# EAGLE design Board_mkIII (EAGLE 6.5.0)
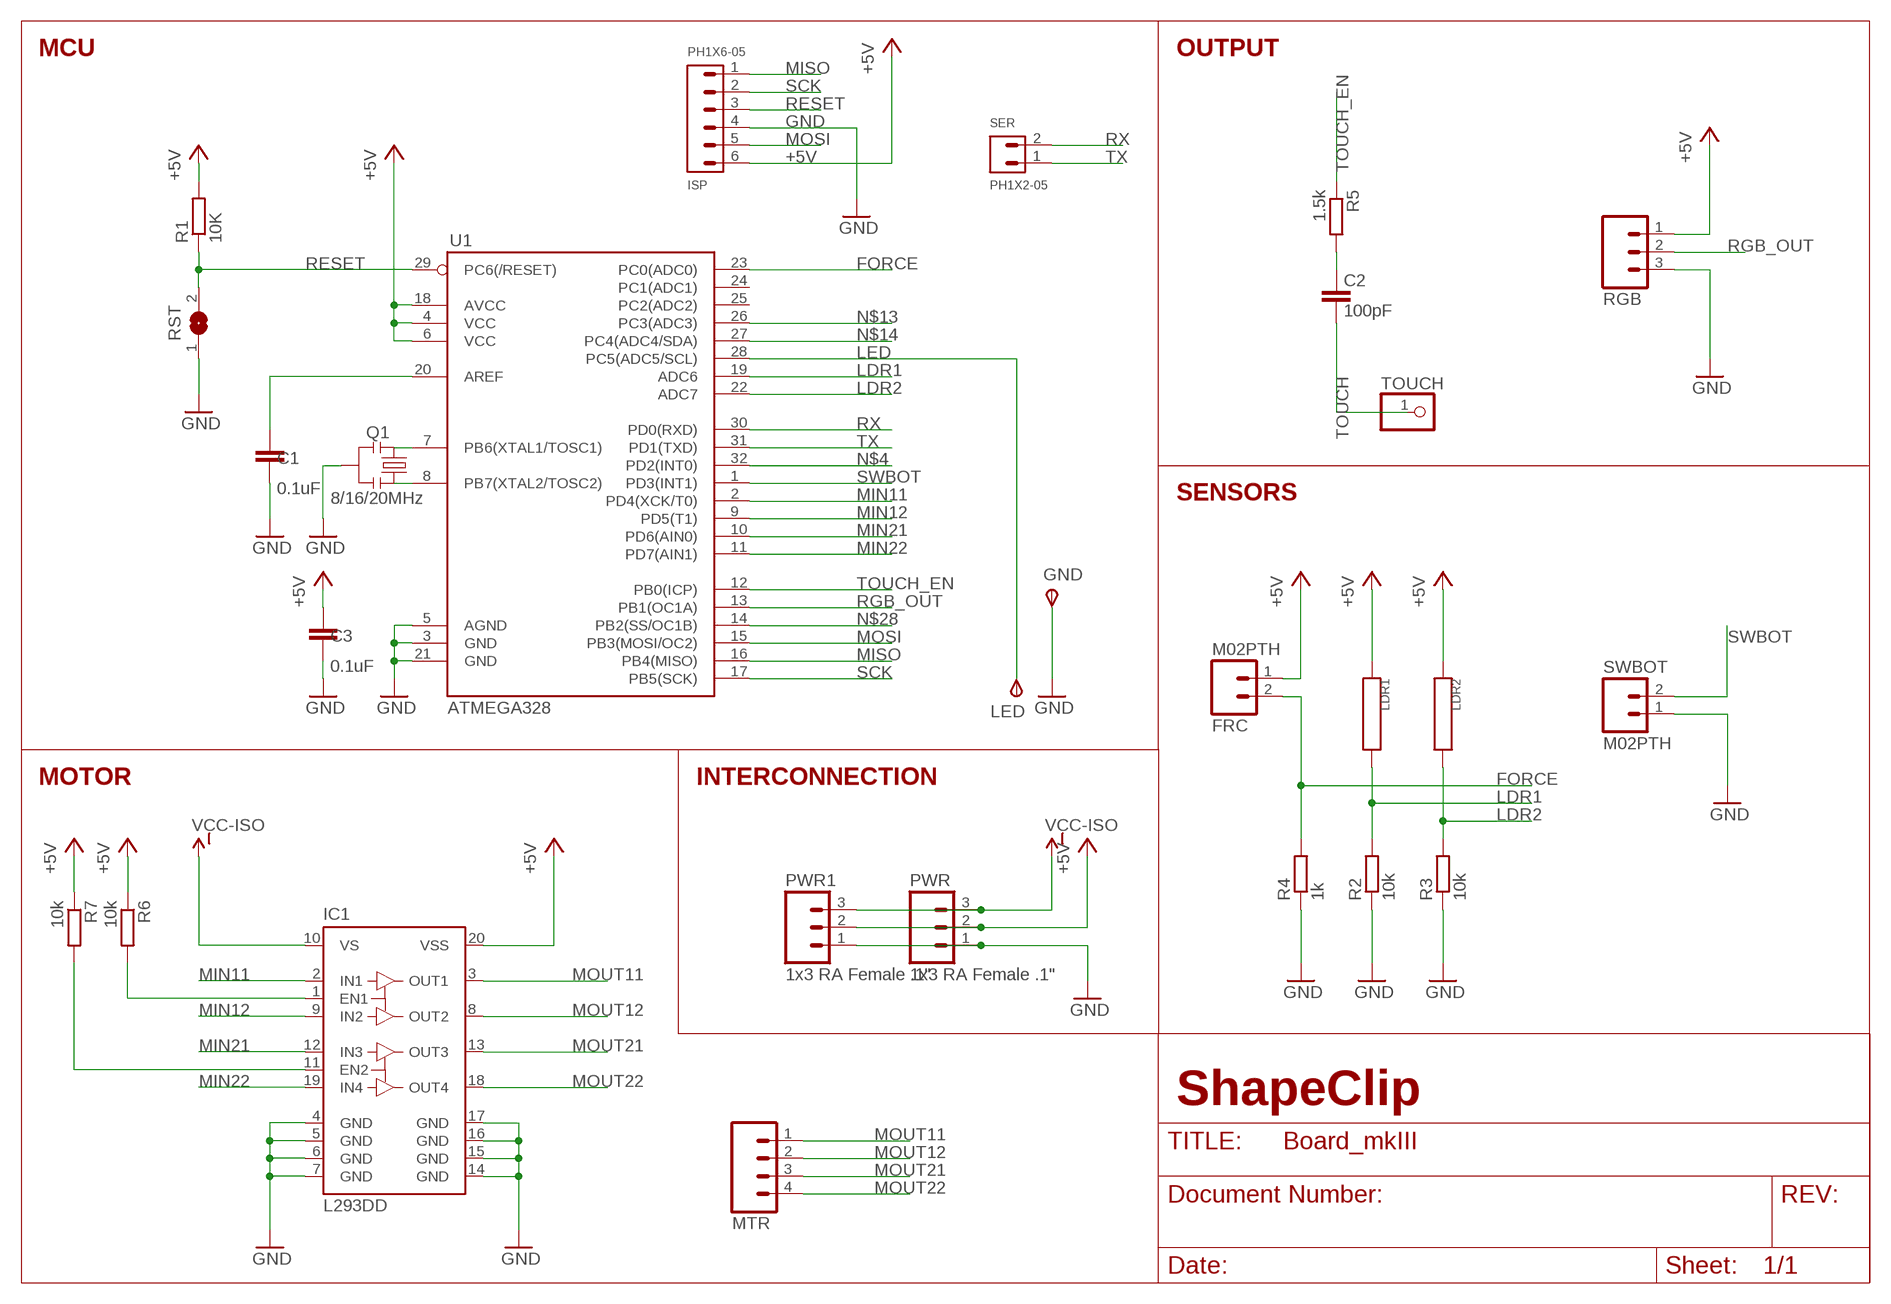
[diagram p0: schematic, sheet 1]

## Parts
C1  0.1uF  C-EUC0603  [C0603]
C2  100pF  C-EUC0603  [C0603]
C3  0.1uF  C-EUC0603  [C0603]
FRC  M02PTH  [1X02]
GND  TPSTP20SQ  [TP20SQ]
IC1  L293DD  [SO20]
ISP  PH1X6-05  [PH005-1-6]
LDR1  DR3-31-LDRLONG  [DR3-31-LDR_L]
LDR2  DR3-31-LDRLONG  [DR3-31-LDR_L]
LED  TPSTP20SQ  [TP20SQ]
MTR  M04PTH  [1X04]
PWR  1x3 RA Female .1"  PHD_FEMALE_3_90DEG  [PHD_FEMALE_3_90DEG]
PWR1  1x3 RA Female .1"  PHD_FEMALE_3_90DEG  [PHD_FEMALE_3_90DEG]
Q1  8/16/20MHz  RESONATOR16MHZ  [RESONATOR-SMD]
R1  10K  R-EU_R0603  [R0603]
R2  10k  R-EU_R0603  [R0603]
R3  10k  R-EU_R0603  [R0603]
R4  1k  R-EU_R0603  [R0603]
R5  1.5k  R-EU_R0603  [R0603]
R6  10k  R-EU_R0603  [R0603]
R7  10k  R-EU_R0603  [R0603]
RGB  M03PTH  [1X03]
RST  SJW  [SJW]
SER  PH1X2-05  [PH005-1-2]
SWBOT  M02PTH  [1X02]
TOUCH  PINHD-1X1  [1X01]
U1  ATMEGA328  ATMEGA168  [TQFP32-08]

## Nets
+5V: C3.2 FRC.1 IC1.20(VSS) ISP.6 LDR1.1 LDR2.1 PWR1.2 PWR.2 R1.2 R6.1 R7.1 RGB.1 U1.4(VCC) U1.6(VCC) U1.18(AVCC)
FORCE: FRC.2 R4.2 U1.23(PC0(ADC0))
GND [vcc]: C1.1 C3.1 GND.TP(PP) IC1.4(GND) IC1.5(GND) IC1.6(GND) IC1.7(GND) IC1.14(GND) IC1.15(GND) IC1.16(GND) IC1.17(GND) ISP.4 PWR1.1 PWR.1 Q1.2 R2.1 R3.1 R4.1 RGB.3 RST.1 SWBOT.1 U1.3(GND) U1.5(AGND) U1.21(GND)
LDR1: LDR1.2 R2.2 U1.19(ADC6)
LDR2: LDR2.2 R3.2 U1.22(ADC7)
LED: LED.TP(PP) U1.28(PC5(ADC5/SCL))
MIN11: IC1.2(IN1) U1.2(PD4(XCK/T0))
MIN12: IC1.9(IN2) U1.9(PD5(T1))
MIN21: IC1.12(IN3) U1.10(PD6(AIN0))
MIN22: IC1.19(IN4) U1.11(PD7(AIN1))
MISO: ISP.1 U1.16(PB4(MISO))
MOSI: ISP.5 U1.15(PB3(MOSI/OC2))
MOUT11: IC1.3(OUT1) MTR.1
MOUT12: IC1.8(OUT2) MTR.2
MOUT21: IC1.13(OUT3) MTR.3
MOUT22: IC1.18(OUT4) MTR.4
N$1: Q1.1 U1.8(PB7(XTAL2/TOSC2))
N$2: Q1.3 U1.7(PB6(XTAL1/TOSC1))
N$3: C1.2 U1.20(AREF)
N$4: U1.32(PD2(INT0))
N$5: C2.2 R5.2
N$6: IC1.1(EN1) R6.2
N$7: IC1.11(EN2) R7.2
N$13: U1.26(PC3(ADC3))
N$14: U1.27(PC4(ADC4/SDA))
N$28: U1.14(PB2(SS/OC1B))
RESET: ISP.3 R1.1 RST.2 U1.29(PC6(/RESET))
RGB_OUT: RGB.2 U1.13(PB1(OC1A))
RX: SER.2 U1.30(PD0(RXD))
SCK: ISP.2 U1.17(PB5(SCK))
SWBOT: SWBOT.2 U1.1(PD3(INT1))
TOUCH: C2.1 TOUCH.1
TOUCH_EN: R5.1 U1.12(PB0(ICP))
TX: SER.1 U1.31(PD1(TXD))
VCC-ISO: IC1.10(VS) PWR1.3 PWR.3
Unconnected: U1.24(PC1(ADC1)) U1.25(PC2(ADC2))

## Notes on the sheet
- MCU | OUTPUT
- SENSORS
- MOTOR | INTERCONNECTION
- ShapeClip

## Library data of the parts
C1-C3 = resistor:C-EU: CAPACITOR, European symbol
FRC SWBOT = SparkFun-Connectors:M02: Standard 2-pin 0.1" header. Use with - straight break away headers ( PRT-00116) - right angle break away headers (PRT-00553) - swiss pins (PRT-00743) - machine pins (PRT-00117) - female headers (PRT-00115) Molex polarized connector foot print use with: PRT-08233 with associated crimp pins and housings. 2.54_SCREWTERM for use with PRT-10571. 3.5mm Screw Terminal footprints for PRT-08084 5mm Screw Terminal footprints for use with PRT-08433
GND LED = testpad:TPS: TEST PIN
IC1 = st-microelectronics:L293DD: PUSH-PULL FOUR CHANNEL DRIVER WITH DIODES Source: http://www.st.com/stonline/books/pdf/docs/1330.pdf; OC_FARNELL: unknown
ISP = pel_hdr:PH1X6
LDR1 LDR2 = ShapeClip:DR3-31-LDR
MTR = SparkFun-Connectors:M04: Header 4 Standard 4-pin 0.1" header. Use with straight break away headers (SKU : PRT-00116), right angle break away headers (PRT-00553), swiss pins (PRT-00743), machine pins (PRT-00117), and female headers (PRT-00115). Molex polarized connector foot print use with SKU : PRT-08231 with associated crimp pins and housings. 1MM SMD Version SKU: PRT-10208
PWR PWR1 = ShapeClip:PHD_FEMALE_3_90DEG
Q1 = SparkFun-FreqCtrl:RESONATOR: Resonator Small SMD resonator. Used, eg, on the Arduino Pro/ Pro Mini boards. 8MHz- XTAL-08895 16MHz- XTAL-08900; PROD_ID: XTAL-08900; VALUE: 16MHz
R1-R7 = resistor:R-EU_: RESISTOR, European symbol
RGB = SparkFun-Connectors:M03: Header 3 Standard 3-pin 0.1" header. Use with straight break away headers (SKU : PRT-00116), right angle break away headers (PRT-00553), swiss pins (PRT-00743), machine pins (PRT-00117), and female headers (PRT-00115). Molex polarized connector foot print use with SKU : PRT-08232 with associated crimp pins and housings.
RST = jumper:SJ: SMD solder JUMPER
SER = pel_hdr:PH1X2
TOUCH = pinhead:PINHD-1X1: PIN HEADER
U1 = SparkFun:ATMEGA168

## Net classes
0 default: width 0.254 mm
1 vcc: width 0.254 mm

## Board
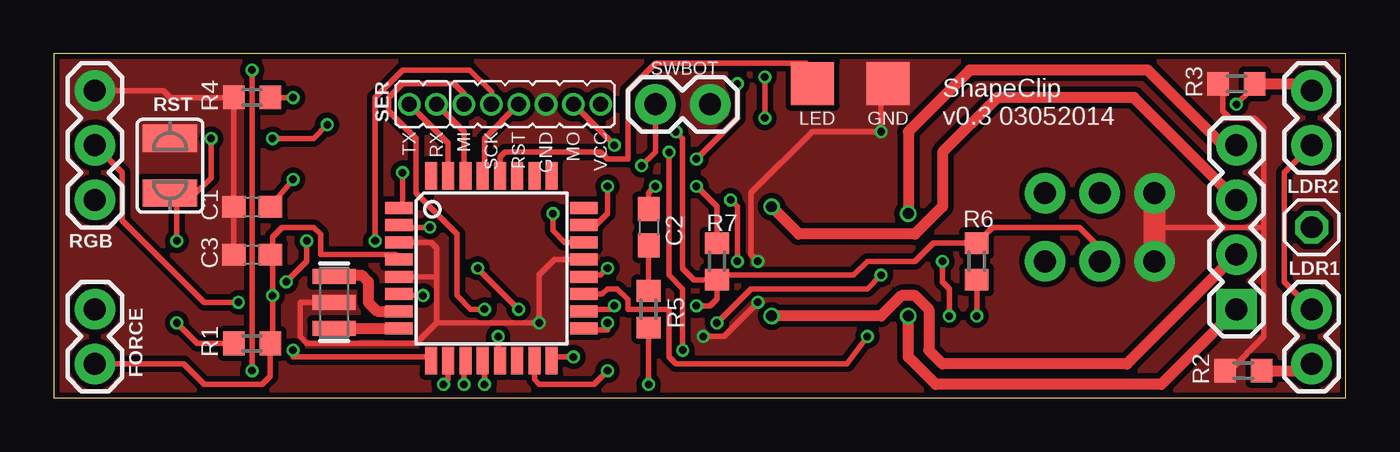
[diagram p1: board, top side]
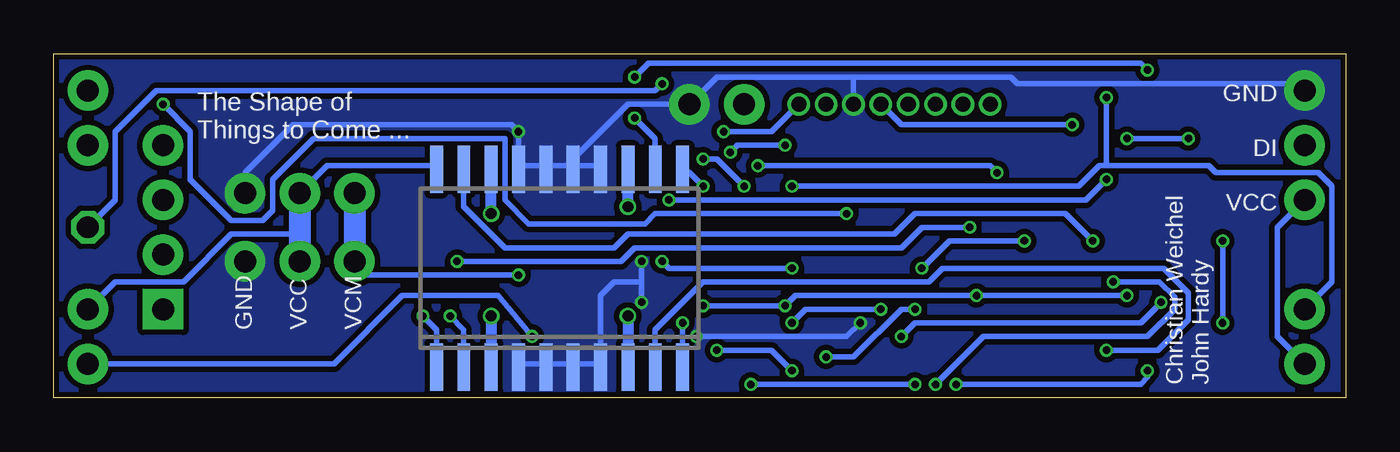
[diagram p2: board, bottom side, seen from below]

Size 60 x 16 mm. Coordinates in mm from the lower left corner, seen from the top.
Outline: 0,0 60,0 60,16 0,16 0,0
Copper layers (1*16): Top 0.018mm / dielectric 1.55mm / Bottom 0.018mm
Design rules "eC_2Layer_PClass6_BaseCopperO18_eCDefault": minimum track width 0.15mm, minimum drill 0.35mm, track to track 0.15mm, track to pad 0.15mm, pad to pad 0.15mm, via to via 0.15mm, smd to smd 0mil, copper to edge 0.25mm, drill to drill 0.35mm, minimum pad ring 0.175mm, minimum via ring 0.125mm, stop-mask expansion 0mil, vias tented up to drill 0.45mm, thermal gap 0.2mm

### Footprints (pad centres in the part's own frame; a part is rotated, then mirrored left to right if it is on the bottom)
C0603 = smd 1.1 x 1: 1 -0.85,0; 2 0.85,0
1X02 = drill 1.016 pad 1.88: 1 0,0; 2 2.54,0
TP20SQ = smd 2 x 2: TP 0,0
SO20 = smd 0.6 x 2.2: 1 -5.715,-4.6; 2 -4.445,-4.6; 3 -3.175,-4.6; 4 -1.905,-4.6; 5 -0.635,-4.6; 6 0.635,-4.6; 7 1.905,-4.6; 8 3.175,-4.6; 9 4.445,-4.6; 10 5.715,-4.6; 11 5.715,4.6; 12 4.445,4.6; 13 3.175,4.6; 14 1.905,4.6; 15 0.635,4.6; 16 -0.635,4.6; 17 -1.905,4.6; 18 -3.175,4.6; 19 -4.445,4.6; 20 -5.715,4.6
PH005-1-6 = drill 0.7 pad 1.016: 1 0,0; 2 1.27,0; 3 2.54,0; 4 3.81,0; 5 5.08,0; 6 6.35,0
DR3-31-LDR_L = drill 1.016 pad 1.88: 1 0,0; 2 2.54,0
1X04 = drill 1.016 pad 1.88 square: 1 0,0 | drill 1.016 pad 1.88: 2 2.54,0; 3 5.08,0; 4 7.62,0
PHD_FEMALE_3_90DEG = drill 1.016 pad 1.88: 1 0,0; 2 2.54,0; 3 5.08,0
RESONATOR-SMD = smd 0.7 x 2.014: 1 -1.2,0; 2 0,0; 3 1.2,0
R0603 = smd 1 x 1.1: 1 -0.85,0; 2 0.85,0
1X03 = drill 1.016 pad 1.88: 1 0,0; 2 2.54,0; 3 5.08,0
SJW = smd 1.27 x 2.54: 1 -1.27,0; 2 1.27,0
PH005-1-2 = drill 0.7 pad 1.016: 1 0,0; 2 1.27,0
1X01 = drill 1.016 octagon: 1 0,0
TQFP32-08 = smd 1.27 x 0.559: 1 -4.293,2.8; 2 -4.293,2; 3 -4.293,1.2; 4 -4.293,0.4; 5 -4.293,-0.4; 6 -4.293,-1.2; 7 -4.293,-2; 8 -4.293,-2.8; 17 4.293,-2.8; 18 4.293,-2; 19 4.293,-1.2; 20 4.293,-0.4; 21 4.293,0.4; 22 4.293,1.2; 23 4.293,2; 24 4.293,2.8 | smd 0.559 x 1.27: 9 -2.8,-4.293; 10 -2,-4.293; 11 -1.2,-4.293; 12 -0.4,-4.293; 13 0.4,-4.293; 14 1.2,-4.293; 15 2,-4.293; 16 2.8,-4.293; 25 2.8,4.293; 26 2,4.293; 27 1.2,4.293; 28 0.4,4.293; 29 -0.4,4.293; 30 -1.2,4.293; 31 -2,4.293; 32 -2.8,4.293

### Placement (x,y rotation side)
C1  9.21,8.89 0 top
C2  27.62,7.94 270 top
C3  9.21,6.67 0 top
FRC  1.91,1.59 90 top
GND  38.73,14.61 0 top
IC1  36.51,6.03 0 bottom
ISP  19.05,13.65 0 top
LDR1  58.42,4.13 270 top
LDR2  58.42,11.75 90 top
LED  35.24,14.61 0 top
MTR  54.93,4.13 90 top
PWR  51.12,9.53 180 top
PWR1  51.12,6.35 0 bottom
Q1  13.02,4.45 90 top
R1  9.21,2.54 0 top
R2  55.24,1.27 0 top
R3  54.93,14.61 0 top
R4  9.21,13.97 0 top
R5  27.62,4.13 90 top
R6  42.86,6.35 270 top
R7  30.8,6.35 90 top
RGB  1.91,9.21 90 top
RST  5.4,10.79 270 top
SER  16.51,13.65 0 top
SWBOT  30.48,13.65 180 top
TOUCH  58.42,7.94 0 top
U1  20.32,6.03 0 top

### Tracks (layer width: path | path; a pad name or v marks a point on that pad's centre or on a via)
+5V  (via drill 0.35)
  Top 0.254: 10.16,2.54 R1.2 | v17.14,4.76 16.19,4.76 U1.6 | 10.16,6.35 10.16,7.49 10.61,7.94 12.06,7.94 12.38,7.62 12.38,6.67 15.88,6.67 U1.4 | 10.16,6.35 C3.2 | U1.18 24.77,4.13 25.88,4.13 v26.04,4.29 | 9.84,2.54 R1.2 | LDR1.1 57.15,5.4 57.15,10.48 LDR2.1 | 42.86,6.99 R6.1 | v28.89,12.38 29.21,12.06 29.21,6.03 29.74,5.5 R7.1 | R7.1 30.8,5.71 37.15,5.71 37.78,6.35 40.01,6.35 40.85,7.2 R6.1 | 30.8,5.4 R7.1 | R6.1 43.6,7.94 47.62,7.94 48.58,6.99 PWR1.2 | FRC.1 6.03,1.59 6.99,0.64 9.67,0.64 10.06,1.02 R1.2 | 10.16,6.35 v10.16,4.76 10.16,2.64 R1.2 | v29.84,4.29 30.48,4.29 30.8,4.6 R7.1
  Bottom 0.254: v10.16,4.76 v17.14,4.76 25.56,4.76 v26.04,4.29 v29.84,4.29 | PWR.2 47.31,10.79 42.23,10.79 IC1.20 | ISP.6 26.67,12.38 v28.89,12.38 | LDR1.1 57.15,5.4 53.98,5.4 51.75,7.62 48.58,7.62 | FRC.1 3.17,2.86 3.17,7.94 RGB.1
  Bottom 1.016: PWR.2 48.58,7.62 PWR1.2
FORCE  (via drill 0.35)
  Top 0.254: v11.11,13.97 R4.2 | v25.72,9.84 25.72,8.57 25.18,8.03 U1.23
  Bottom 0.254: v25.72,9.84 12.38,9.84 11.43,10.79 11.11,10.79 | FRC.2 0.64,5.4 0.64,9.84 1.27,10.48 6.03,10.48 6.35,10.79 11.11,10.79 | v11.11,13.97 11.11,10.79
GND  (via drill 0.35)
  Top 0.254: 8.57,6.35 C3.1 8.36,9.95 | R2.1 54.61,1.27 56.2,2.86 56.2,7.94 | 56.2,7.94 56.2,12.57 55.75,13.02 54.61,13.02 54.29,13.34 54.29,14.61 R3.1 | 16.19,5.71 U1.5 17.7,5.63 17.78,5.71 | 16.19,7.3 U1.3 17.53,7.23 17.78,6.99 17.78,5.71 | 24.45,6.35 U1.21 23.26,6.43 22.54,5.71 v22.54,3.49 17.78,3.49 | Q1.2 11.43,4.45 11.43,2.86 11.75,2.54 16.83,2.54 17.78,3.49 | GND.TP 38.42,14.29 v38.42,12.38 35.23,12.38 32.38,9.54 32.38,6.67 v32.7,6.35 | v30.16,2.86 31.11,2.86 v32.7,4.45 | 56.2,7.94 51.12,7.94 | 17.78,3.49 17.78,5.71 | C1.1 R4.1 5.4,13.97 5.08,14.29 RGB.3
  Top 1.016: PWR.1 51.12,7.94 PWR1.1
  Bottom 0.254: 22.86,14.92 ISP.4 | 22.86,14.92 29.21,14.92 SWBOT.1 33.34,13.65 36.2,10.79 | 35.88,1.59 34.61,1.59 IC1.7 34.61,4.76 33.97,5.4 32.7,5.4 | 35.88,1.59 37.15,1.59 | 35.88,1.59 IC1.6 | 37.15,1.59 38.42,1.59 IC1.4 | 37.15,1.59 IC1.5 | 35.88,10.79 34.61,10.79 IC1.14 | 35.88,10.79 36.2,10.79 | 36.2,10.79 37.15,10.79 | 35.88,10.79 IC1.15 | 38.42,10.79 v38.42,12.38 38.73,12.7 48.9,12.7 51.12,10.48 PWR.1 | 38.42,10.79 37.15,10.79 | 37.15,10.79 IC1.16 | 38.42,10.79 IC1.17 | v30.16,2.86 23.18,2.86 v22.54,3.49 | 22.86,14.92 15.56,14.92 15.24,14.61 2.22,14.61 RGB.3 | v32.7,6.35 32.7,5.4 | 32.7,5.4 v32.7,4.45
  pour Top (isolate 0.254, rank 6, no thermals): 0,16 0,0 60,0 60,16
  pour Bottom (isolate 0.254, rank 6, no thermals): 0,16 0,0 60,0 60,16
LDR1  (via drill 0.35)
  Top 0.254: v37.78,2.86 36.83,1.59 28.89,1.59 28.57,1.91 28.57,4.13 26.67,4.13 26.67,4.58 26.17,5.08 25.72,5.08 25.47,4.83 U1.19
  Top 0.508: R2.2 58.1,1.27 LDR1.2
  Bottom 0.254: v37.78,2.86 39.37,4.76 43.81,4.76 46.99,1.59 LDR1.2
LDR2  (via drill 0.35)
  Top 0.254: v54.93,13.65 55.56,14.29 55.56,14.61 R3.2 | v23.18,8.57 23.18,7.78 23.72,7.23 U1.22
  Top 0.508: R3.2 58.1,14.61 LDR2.2
  Bottom 0.254: v23.18,8.57 32.07,8.57 32.54,8.1 37.94,8.1 39.05,9.21 39.05,12.06 47.94,12.06 49.85,10.16 49.85,8.7 50.3,8.26 51.75,8.26 53.66,10.16 53.66,12.38 v54.93,13.65
LED
  Top 0.254: U1.28 20.72,11.2 20.95,11.43 25.4,11.43 25.72,11.11 26.67,11.11 26.67,14.29 27.94,15.56 34.92,15.56 35.24,15.24 LED.TP
MIN11  (via drill 0.35)
  Top 0.254: v17.46,7.94 16.19,7.94 U1.2 | v41.59,3.81 41.59,5.08 41.27,5.4 v41.27,6.35
  Bottom 0.254: v17.46,7.94 19.68,7.94 20.64,6.99 33.02,6.99 33.66,6.35 v41.27,6.35 | v41.59,3.81 40.96,3.17 IC1.2
MIN12  (via drill 0.35)
  Top 0.254: v11.11,2.22 11.11,1.91 17.46,1.91 U1.9
  Bottom 0.254: v11.11,2.22 8.72,2.22 7.3,3.64 7.3,4.89 8.45,6.03 18.73,6.03 19.37,5.4 29.84,5.4 32.07,3.17 IC1.9
MIN21  (via drill 0.35)
  Top 0.254: v9.21,15.24 v9.21,1.27 | v33.02,13.02 v33.02,14.92 | v18.1,0.64 18.32,0.86 U1.10
  Bottom 0.254: v9.21,1.27 9.21,0.95 9.53,0.64 v18.1,0.64 | v9.21,15.24 9.53,15.56 32.38,15.56 v33.02,14.92 | v33.02,13.02 32.07,12.06 IC1.12
MIN22  (via drill 0.35)
  Top 0.254: v19.05,0.64 19.05,1.59 U1.11 | v10.79,5.4 11.75,6.35 v11.75,7.3
  Bottom 0.254: v19.05,0.64 16.83,2.86 9.21,2.86 7.94,4.13 7.94,4.69 8.65,5.4 v10.79,5.4 | v11.75,7.3 13.02,8.57 20,8.57 20.95,7.62 33.34,7.62 33.97,6.99 39.05,6.99 40.96,8.89 IC1.19
MISO  (via drill 0.35)
  Top 0.254: v24.13,1.91 23.18,1.91 U1.16 | ISP.1 19.05,14.16 18.6,14.61 16.19,14.61 15.56,13.97 15.56,13.34 16.83,12.06 16.83,9.53 18.73,7.62 18.73,4.76 19.37,4.13 v20,4.13
  Bottom 0.254: v20,4.13 20.64,4.13 22.86,1.91 v24.13,1.91
MOSI  (via drill 0.35)
  Top 0.254: v29.21,2.22 29.21,5.08 28.57,5.71 v28.57,11.43 | ISP.5 v26.04,11.75 | U1.15 22.32,0.86 22.54,0.64 25.08,0.64 v25.72,1.27
  Bottom 0.254: v25.72,1.27 26.67,2.22 v29.21,2.22 | v28.57,11.43 28.26,11.75 v26.04,11.75
MOUT11  (via drill 0.51)
  Top 0.508: MTR.1 51.44,0.64 40.96,0.64 39.69,1.91 v39.69,3.81
  Bottom 0.508: v39.69,3.81 IC1.3
MOUT12  (via drill 0.51)
  Top 0.508: MTR.2 49.85,1.59 41.27,1.59 40.64,2.22 40.64,4.13 40.01,4.76 39.37,4.76 38.42,3.81 v33.34,3.81
  Bottom 0.508: v33.34,3.81 IC1.8
MOUT21  (via drill 0.51)
  Top 0.508: MTR.3 50.16,13.97 43.81,13.97 41.27,11.43 41.27,8.89 40.01,7.62 34.61,7.62 v33.34,8.89
  Bottom 0.508: v33.34,8.89 IC1.13
MOUT22  (via drill 0.51)
  Top 0.508: MTR.4 54.29,11.75 50.8,15.24 42.55,15.24 39.69,12.38 v39.69,8.57
  Bottom 0.508: v39.69,8.57 IC1.18
N$1
  Top 0.508: Q1.1 13.03,3.23 U1.8
N$2
  Top 0.508: Q1.3 13.09,5.71 14.29,5.71 14.61,5.4 14.61,4.45 15.02,4.03 U1.7
N$3  (via drill 0.35)
  Top 0.254: v11.11,10.16 C1.2 | v31.43,9.21 31.75,8.89 v31.75,6.35 | v25.72,6.03 25.4,5.71 24.77,5.71 U1.20
  Bottom 0.254: v11.11,10.16 12.06,9.21 v31.43,9.21 | v31.75,6.35 31.43,6.03 v25.72,6.03
N$5
  Top 0.254: C2.2 R5.2
N$6  (via drill 0.35)
  Top 0.254: v42.86,3.81 R6.2
  Bottom 0.254: 42.23,1.59 IC1.1 42.23,3.17 v42.86,3.81
N$7  (via drill 0.35)
  Top 0.254: 30.8,7.3 R7.2 30.8,8.89 v29.84,9.84
  Bottom 0.254: v29.84,9.84 30.48,10.48 30.8,10.48 IC1.11
RESET  (via drill 0.35)
  Top 0.254: ISP.3 20,12.06 20,10.48 U1.29 | v5.71,7.3 5.71,9.21 RST.2 6.59,9.53 7.3,10.23 v7.3,12.06 | v5.71,3.49 6.67,2.54 R1.1 | v12.7,12.7 12.06,12.06 v10.16,12.06
  Bottom 0.254: v12.7,12.7 20.64,12.7 ISP.3 | v5.71,7.3 v5.71,3.49 | v10.16,12.06 v7.3,12.06
RGB_OUT  (via drill 0.35)
  Top 0.254: v20.64,2.86 20.64,1.91 U1.13 | RGB.2 3.17,10.48 3.17,8.26 6.99,4.45 v8.57,4.45
  Bottom 0.254: v20.64,2.86 20,3.49 9.53,3.49 v8.57,4.45
RX
  Top 0.254: SER.2 19.05,12.38 19.05,10.48 U1.30
SCK  (via drill 0.35)
  Top 0.254: v25.72,3.49 25.72,3.17 24.77,3.17 U1.17 | v19.68,6.03 v21.59,4.13 | v14.92,7.3 14.92,13.97 16.19,15.24 19.32,15.24 20.32,14.24 ISP.2
  Bottom 0.254: v25.72,3.49 25.08,4.13 v21.59,4.13 | v19.68,6.03 18.41,7.3 v14.92,7.3
SWBOT  (via drill 0.35)
  Top 0.254: v16.19,10.48 16.19,8.89 U1.1 | v27.3,10.79 27.94,11.43 SWBOT.2
  Bottom 0.254: v16.19,10.48 16.51,10.79 v27.3,10.79
TOUCH  (via drill 0.35)
  Top 0.254: 27.94,9.21 27.62,8.89 C2.1 27.62,9.53 v27.94,9.84 | v29.84,11.11 31.75,13.02 v31.75,14.61
  Bottom 0.254: v27.94,9.84 29.21,11.11 v29.84,11.11 | v31.75,14.61 32.07,14.29 55.24,14.29 57.15,12.38 57.15,9.21 TOUCH.1
TOUCH_EN  (via drill 0.35)
  Top 0.254: v20,0.64 20,1.59 U1.12 | 27.62,3.17 R5.1 v27.62,0.64
  Bottom 0.254: v20,0.64 v27.62,0.64
TX
  Top 0.254: SER.1 18.32,11.84 U1.31
VCC-ISO  (via drill 0.35)
  Top 0.254: v30.8,3.49 32.38,5.08 37.78,5.08 v38.42,5.71
  Bottom 0.254: v30.8,3.49 IC1.10 | v38.42,5.71 45.4,5.71 PWR1.3
  Bottom 1.016: PWR.3 PWR1.3

### Text on the board
tNames: ShapeClip / v0.3 03052014 | TX | RX | MI | SCK | RST | GND | MO | VCC | FORCE
bNames: GND | DI | The Shape of / Things to Come ... | VCC | VCM | VCC | GND | Christian Weichel / John Hardy